# Altium schematic sheet TDC.SchDoc: ACAM TDC + power supply
size 297 x 209 mm; CheckedBy: -; CompanyName: CERN; DrawnBy: GK, TW; Organization: CERN; Address1: European Organization for Nuclear Research; Address2: CH-1211 Genève 23 - Switzerland; Revision: -; SheetNumber: 7; SheetTotal: 9; EDA_Number: EDA-02267-V2-0; Projet: FMC Delay 1ns 4cha; ModifiedBy: -; CreateDate: XX/XX/XXXX; CheckedDate: -; DivGrp: BE-CO; Designer: GK, TW; ModifiedDate: -
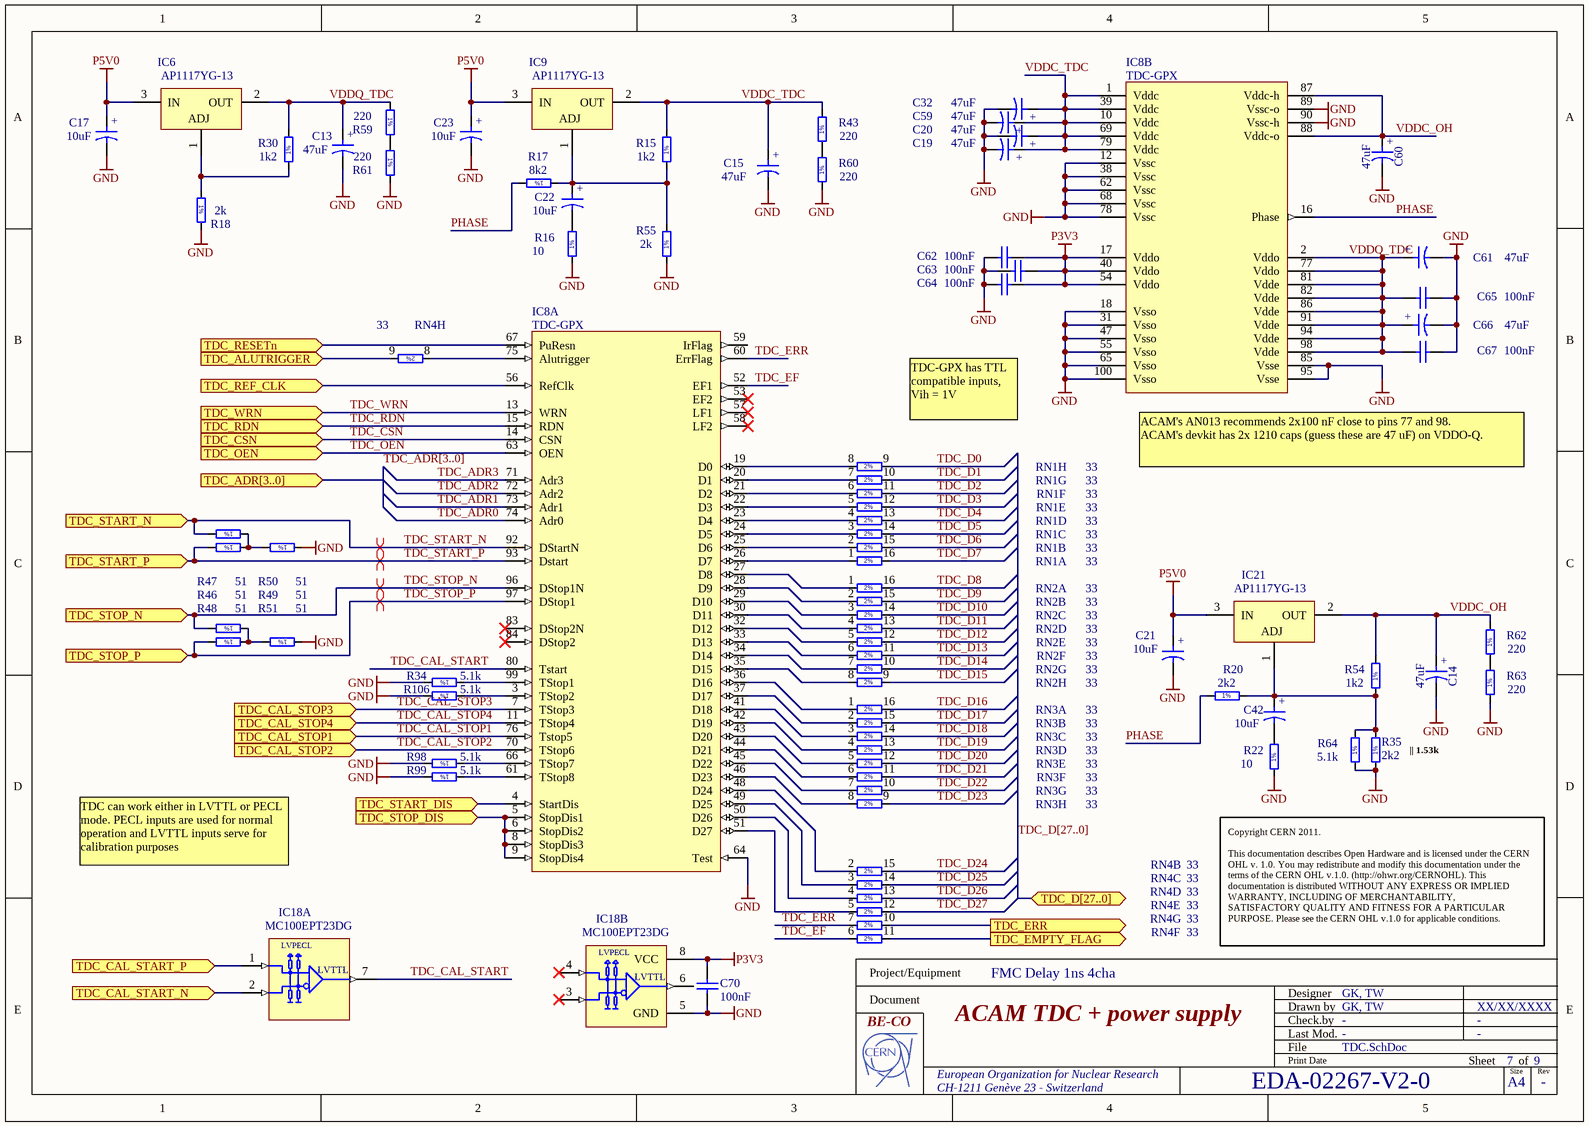
[diagram p0: TDC.SchDoc]

## Parts
C13  47uF  [CAPMP3528X210N]
C14  47uF  [CAPMP3528X210N]
C15  47uF  [CAPMP3528X210N]
C17  10uF  [CAPMP3216X180N]
C19  47uF  [CAPMP3528X210N]
C20  47uF  [CAPMP3528X210N]
C21  10uF  [CAPMP3216X180N]
C22  10uF  [CAPMP3216X180N]
C23  10uF  [CAPMP3216X180N]
C32  47uF  [CAPMP3528X210N]
C42  10uF  [CAPMP3216X180N]
C59  47uF  [CAPMP3528X210N]
C60  47uF  [CAPMP3528X210N]
C61  47uF  [CAPMP3528X210N]
C62  100nF  [CAPC1608X87N]
C63  100nF  [CAPC1608X87N]
C64  100nF  [CAPC1608X87N]
C65  100nF  [CAPC1608X87N]
C66  47uF  [CAPMP3528X210N]
C67  100nF  [CAPC1608X87N]
C70  100nF  [CAPC1608X87N]
IC6  AP1117YG-13  [SOT89]
IC8  TDC-GPX  [QFP50P1600X1600X120-100N]  (parts A,B of 2)
IC9  AP1117YG-13  [SOT89]
IC18  MC100EPT23DG  [SOIC127P600X175-8N]  (parts A,B of 2)
IC21  AP1117YG-13  [SOT89]
R15  1k2  [RESC1608X55N]
R16  10  [RESC1608X55N]
R17  8k2  [RESC1608X55N]
R18  2k  [RESC1608X55N]
R20  2k2  [RESC1608X55N]
R22  10  [RESC1608X55N]
R30  1k2  [RESC1608X55N]
R34  5.1k  [RESC1608X55N]
R35  2k2  [RESC1608X55N]
R43  220  [RESC1608X55N]
R46  51  [RESC1608X55N]
R47  51  [RESC1608X55N]
R48  51  [RESC1608X55N]
R49  51  [RESC1608X55N]
R50  51  [RESC1608X55N]
R51  51  [RESC1608X55N]
R54  1k2  [RESC1608X55N]
R55  2k  [RESC1608X55N]
R59  220  [RESC1608X55N]
R60  220  [RESC1608X55N]
R61  220  [RESC1608X55N]
R62  220  [RESC1608X55N]
R63  220  [RESC1608X55N]
R64  5.1k  [RESC1608X55N]
R98  5.1k  [RESC1608X55N]
R99  5.1k  [RESC1608X55N]
R106  5.1k  [RESC1608X55N]
RN1  33  [RN_YAGEO_YC248]  (parts A,B,C,D,E,F,G,H of 8)
RN2  33  [RN_YAGEO_YC248]  (parts A,B,C,D,E,F,G,H of 8)
RN3  33  [RN_YAGEO_YC248]  (parts A,B,C,D,E,F,G,H of 8)
RN4  33  [RN_YAGEO_YC248]  (parts B,C,D,E,F,G,H of 8)

## Ports
TDC_ADR[3..0] (in), TDC_ALUTRIGGER (in), TDC_CAL_START_N (in), TDC_CAL_START_P (in), TDC_CAL_STOP1 (in), TDC_CAL_STOP2 (in), TDC_CAL_STOP3 (in), TDC_CAL_STOP4 (in), TDC_CSN (in), TDC_D[27..0] (bidir), TDC_EMPTY_FLAG (out), TDC_ERR (out), TDC_OEN (in), TDC_RDN (in), TDC_REF_CLK (in), TDC_RESETn (in), TDC_START_DIS (in), TDC_START_N (in), TDC_START_P (in), TDC_STOP_DIS (in), TDC_STOP_N (in), TDC_STOP_P (in), TDC_WRN (in)

## Nets
GND: C13.2 C14.2 C15.2 C17.2 C19.2 C20.2 C21.2 C23.2 C32.2 C59.2 C60.2 C61.2 C62.2 C63.1 C64.1 C65.2 C66.2 C67.2 C70.1 IC8.12(Vssc) IC8.18(Vsso) IC8.31(Vsso) IC8.38(Vssc) IC8.47(Vsso) IC8.55(Vsso) IC8.62(Vssc) IC8.64(Test) IC8.65(Vsso) IC8.68(Vssc) IC8.78(Vssc) IC8.85(Vsse) IC8.89(Vssc-o) IC8.90(Vssc-h) IC8.95(Vsse) IC8.100(Vsso) IC18.5(GND) R16.1 R18.2 R22.1 R34.2 R35.1 R48.1 R51.1 R55.1 R60.1 R61.2 R63.1 R64.1 R98.2 R99.2 R106.2
P3V3: C62.1 C63.2 C64.2 C70.2 IC8.17(Vddo) IC8.40(Vddo) IC8.54(Vddo) IC18.8(VCC)
P5V0: C17.1 C21.1 C23.1 IC6.3(IN) IC9.3(IN) IC21.3(IN)
PHASE: IC8.16(Phase) R17.2 R20.1
TDC_ADR0: IC8.74(Adr0)
TDC_ADR1: IC8.73(Adr1)
TDC_ADR2: IC8.72(Adr2)
TDC_ADR3: IC8.71(Adr3)
TDC_ALUTRIGGER: RN4.9 ; port TDC_ALUTRIGGER
TDC_CAL_START: IC8.80(Tstart) IC18.7(Q0)
TDC_CAL_START_N: IC18.2(~{D0}) ; port TDC_CAL_START_N
TDC_CAL_START_P: IC18.1(D0) ; port TDC_CAL_START_P
TDC_CAL_STOP1: IC8.76(Tstop5) ; port TDC_CAL_STOP1
TDC_CAL_STOP2: IC8.70(TStop6) ; port TDC_CAL_STOP2
TDC_CAL_STOP3: IC8.7(TStop3) ; port TDC_CAL_STOP3
TDC_CAL_STOP4: IC8.11(TStop4) ; port TDC_CAL_STOP4
TDC_CSN: IC8.14(CSN) ; port TDC_CSN
TDC_D0: RN1.9
TDC_D1: RN1.10
TDC_D2: RN1.11
TDC_D3: RN1.12
TDC_D4: RN1.13
TDC_D5: RN1.14
TDC_D6: RN1.15
TDC_D7: RN1.16
TDC_D8: RN2.16
TDC_D9: RN2.15
TDC_D10: RN2.14
TDC_D11: RN2.13
TDC_D12: RN2.12
TDC_D13: RN2.11
TDC_D14: RN2.10
TDC_D15: RN2.9
TDC_D16: RN3.16
TDC_D17: RN3.15
TDC_D18: RN3.14
TDC_D19: RN3.13
TDC_D20: RN3.12
TDC_D21: RN3.11
TDC_D22: RN3.10
TDC_D23: RN3.9
TDC_D24: RN4.15
TDC_D25: RN4.14
TDC_D26: RN4.13
TDC_D27: RN4.12
TDC_EF: IC8.52(EF1) RN4.6
TDC_EMPTY_FLAG: RN4.11 ; port TDC_EMPTY_FLAG
TDC_ERR: IC8.60(ErrFlag) RN4.7
TDC_ERR: RN4.10 ; port TDC_ERR  [a separate net that carries the same name]
TDC_OEN: IC8.63(OEN) ; port TDC_OEN
TDC_RDN: IC8.15(RDN) ; port TDC_RDN
TDC_REF_CLK: IC8.56(RefClk) ; port TDC_REF_CLK
TDC_RESETn: IC8.67(PuResn) ; port TDC_RESETn
TDC_START_DIS: IC8.4(StartDis) ; port TDC_START_DIS
TDC_START_N: IC8.92(DStartN) R50.2 ; port TDC_START_N
TDC_START_P: IC8.93(Dstart) R49.2 ; port TDC_START_P
TDC_STOP_DIS: IC8.5(StopDis1) IC8.6(StopDis2) IC8.8(StopDis3) IC8.9(StopDis4) ; port TDC_STOP_DIS
TDC_STOP_N: IC8.96(DStop1N) R47.2 ; port TDC_STOP_N
TDC_STOP_P: IC8.97(DStop1) R46.2 ; port TDC_STOP_P
TDC_WRN: IC8.13(WRN) ; port TDC_WRN
VDDC_OH: C14.1 C60.1 IC8.87(Vddc-h) IC8.88(Vddc-o) IC21.2(OUT) R54.2 R62.2
VDDC_TDC: C15.1 C19.1 C20.1 C32.1 C59.1 IC8.1(Vddc) IC8.10(Vddc) IC8.39(Vddc) IC8.69(Vddc) IC8.79(Vddc) IC9.2(OUT) R15.2 R43.2
VDDQ_TDC: C13.1 C61.1 C65.1 C66.1 C67.1 IC6.2(OUT) IC8.2(Vddo) IC8.77(Vddo) IC8.81(Vdde) IC8.82(Vdde) IC8.86(Vdde) IC8.91(Vdde) IC8.94(Vdde) IC8.98(Vdde) R30.2 R59.1
NetC22_1: C22.1 IC9.1(ADJ) R15.1 R17.1 R55.2
NetC22_2: C22.2 R16.2
NetC42_1: C42.1 IC21.1(ADJ) R20.2 R35.2 R54.1 R64.2
NetC42_2: C42.2 R22.2
NetIC6_1: IC6.1(ADJ) R18.1 R30.1
NetIC8_3: IC8.3(TStop2) R106.1
NetIC8_19: IC8.19(D0) RN1.8
NetIC8_20: IC8.20(D1) RN1.7
NetIC8_21: IC8.21(D2) RN1.6
NetIC8_22: IC8.22(D3) RN1.5
NetIC8_23: IC8.23(D4) RN1.4
NetIC8_24: IC8.24(D5) RN1.3
NetIC8_25: IC8.25(D6) RN1.2
NetIC8_26: IC8.26(D7) RN1.1
NetIC8_27: IC8.27(D8) RN2.1
NetIC8_28: IC8.28(D9) RN2.2
NetIC8_29: IC8.29(D10) RN2.3
NetIC8_30: IC8.30(D11) RN2.4
NetIC8_32: IC8.32(D12) RN2.5
NetIC8_33: IC8.33(D13) RN2.6
NetIC8_34: IC8.34(D14) RN2.7
NetIC8_35: IC8.35(D15) RN2.8
NetIC8_36: IC8.36(D16) RN3.1
NetIC8_37: IC8.37(D17) RN3.2
NetIC8_41: IC8.41(D18) RN3.3
NetIC8_42: IC8.42(D19) RN3.4
NetIC8_43: IC8.43(D20) RN3.5
NetIC8_44: IC8.44(D21) RN3.6
NetIC8_45: IC8.45(D22) RN3.7
NetIC8_46: IC8.46(D23) RN3.8
NetIC8_48: IC8.48(D24) RN4.2
NetIC8_49: IC8.49(D25) RN4.3
NetIC8_50: IC8.50(D26) RN4.4
NetIC8_51: IC8.51(D27) RN4.5
NetIC8_61: IC8.61(TStop8) R99.1
NetIC8_66: IC8.66(TStop7) R98.1
NetIC8_75: IC8.75(Alutrigger) RN4.8
NetIC8_99: IC8.99(TStop1) R34.1
NetR43_1: R43.1 R60.2
NetR46_1: R46.1 R47.1 R48.2
NetR49_1: R49.1 R50.1 R51.2
NetR59_2: R59.2 R61.1
NetR62_1: R62.1 R63.2

Not connected (* = marked no-connect by the designer): IC8 53(EF2)* 57(LF1)* 58(LF2)* 59(IrFlag) 83(DStop2N)* 84(DStop2)*; IC18 3(~{D0})* 4(D0)* 6(Q0)

## Buses and harness runs
bus TDC_ADR[3..0] = port TDC_ADR[3..0]
bus TDC_D[27..0] = port TDC_D[27..0]

## Layout directives
differential pair: TDC_START_N, TDC_START_P, TDC_STOP_N, TDC_STOP_P

## Notes on the sheet
- TDC-GPX has TTL compatible inputs, Vih = 1V
- (near IC8) ACAM's AN013 recommends 2x100 nF close to pins 77 and 98.
  ACAM's devkit has 2x 1210 caps (guess these are 47 uF) on VDDO-Q.
- || 1.53k
- TDC can work either in LVTTL or PECL mode. PECL inputs are used for normal operation and LVTTL inputs serve for calibration purposes
- Copyright CERN 2011.
  This documentation describes Open Hardware and is licensed under the CERN OHL v. 1.0. You may redistribute and modify this documentation under the terms of the CERN OHL v.1.0. (http://ohwr.org/CERNOHL). This documentation is distributed WITHOUT ANY EXPRESS OR IMPLIED WARRANTY, INCLUDING OF MERCHANTABILITY, SATISFACTORY QUALITY AND FITNESS FOR A PARTICULAR PURPOSE. Please see the CERN OHL v.1.0 for applicable conditions.
- Project/Equipment
- Document
- Designer
- Drawn by
- Check.by
- File
- Last Mod.
- Print Date
- Sheet
- Size
- A4
- of
- Rev
- (in symbol CTE3216-18_10UF_10V_10%_LESR1800) +
- (in symbol CTE3528-21_47UF_6.3V_10%_LESR0250) +
- (in symbol MC100EPT23DG, part A) LVPECL; LVTTL
- (in symbol MC100EPT23DG, part B) LVPECL; LVTTL
- (in symbol R0603_1K2_1%_0.1W_100PPM) 1%
- (in symbol R0603_2K2_1%_0.1W_100PPM) 1%
- (in symbol R0603_2K_1%_0.1W_100PPM) 1%
- (in symbol R0603_5K1_1%_0.1W_100PPM) 1%
- (in symbol R0603_8K2_1%_0.1W_100PPM) 1%
- (in symbol R0603_10R_1%_0.1W_200PPM) 1%
- (in symbol R0603_51R_1%_0.1W_100PPM) 1%
- (in symbol R0603_220R_1%_0.1W_100PPM) 1%
- (in symbol RN_33R_YAGEO_YC248-JR-0733RL, part A) 2%
- (in symbol RN_33R_YAGEO_YC248-JR-0733RL, part B) 2%
- (in symbol RN_33R_YAGEO_YC248-JR-0733RL, part C) 2%
- (in symbol RN_33R_YAGEO_YC248-JR-0733RL, part D) 2%
- (in symbol RN_33R_YAGEO_YC248-JR-0733RL, part E) 2%
- (in symbol RN_33R_YAGEO_YC248-JR-0733RL, part F) 2%
- (in symbol RN_33R_YAGEO_YC248-JR-0733RL, part G) 2%
- (in symbol RN_33R_YAGEO_YC248-JR-0733RL, part H) 2%

## Library data of the parts
C13-C15 C19 C20 C32 C59-C61 C66 = CTE3528-21_47UF_6.3V_10%_LESR0250: Polarised capacitor; Part Description: Low ESR 0R25 Solid Tantalum Chip Capacitor; Manufacturer: GENERIC; Manufacturer1 Part Number: TPSB476K006R0250; Voltage: 6.3V; Tolerance: ±10%; Table: Capacitors SMD; Part Number: CTE3528-21_47UF_6.3V_10%_LESR0250; Component Kind: Standard; Component Type: Standard; Pin Count: 2; Value: 47uF; Status: Preferred; Manufacturer Part Number: CTE3528-21_47UF_6.3V_10%_LESR0250; Case: B; Mounted: Yes; Socket: No; SMD: Yes; Manufacturer1 Example: AVX; Manufacturer1 ComponentHeight: 2.1mm; HelpURL: \\cern.ch\dfs\Applications\Altium\Datasheets\CTE-LESR_AVX_TPS.pdf; Author: CERN DEM JLC; CreateDate: 5/5/2008; LatestRevisionDate: 1/20/2009
C17 C21-C23 C42 = CTE3216-18_10UF_10V_10%_LESR1800: Polarised capacitor; Part Description: Low ESR 1R8 Solid Tantalum Chip Capacitor; Manufacturer: GENERIC; Manufacturer1 Part Number: TPSA106K010R1800; Voltage: 10V; Tolerance: ±10%; Table: Capacitors SMD; Part Number: CTE3216-18_10UF_10V_10%_LESR1800; Component Kind: Standard; Component Type: Standard; Pin Count: 2; Value: 10uF; Status: Preferred; Manufacturer Part Number: CTE3216-18_10UF_10V_10%_LESR1800; Case: A; Mounted: Yes; Socket: No; SMD: Yes; Manufacturer1 Example: AVX; Manufacturer1 ComponentHeight: 1.8mm; HelpURL: \\cern.ch\dfs\Applications\Altium\Datasheets\CTE-LESR_AVX_TPS.pdf; Author: CERN DEM JLC; CreateDate: 5/5/2008; LatestRevisionDate: 1/20/2009
C62-C65 C67 C70 = CC0603_100NF_50V_10%_X7R: Non-polarised capacitor; Manufacturer1 Part Number: 223858615649; Manufacturer: GENERIC; Part Description: SMD Multilayer Chip Ceramic Capacitor; Table: Capacitors SMD; TC: X7R; Tolerance: ±10%; Voltage: 50V; Author: CERN DEM JLC; Case: 0603; Component Type: Standard; CreateDate: 12/3/2007; HelpURL: \\cern.ch\dfs\Applications\Altium\Datasheets\CC0603_X7R_PHYCOMP.pdf; LatestRevisionDate: 12/3/2007; Manufacturer1 ComponentHeight: 0.87mm; Manufacturer1 Example: PHYCOMP; Manufacturer Part Number: CC0603_100NF_50V_10%_X7R; Mounted: Yes; Pin Count: 2; SMD: Yes; Socket: No; Status: Preferred; Value: 100nF; Part Number: CC0603_100NF_50V_10%_X7R; Component Kind: Standard
IC6 IC9 IC21 = AP1117YG-13: 3-Terminal Regulator 1=Adj 2=OUT 3=IN; Part Description: 1.25V To 5V, 1A Low-Dropout Positive Adjustable Voltage Regulator; Manufacturer: DIODES INCORPORATED; Table: Regulators; Part Number: AP1117YG-13; Component Kind: Standard; Component Type: Standard; Device: AP1117YG-13; PackageDescription: SOT89-3, 3-Leads, Body 2.48x4.5mm; Manufacturer Part Number: AP1117YG-13; Pin Count: 3; Case: SOT89; Mounted: Yes; Socket: No; SMD: Yes; ComponentHeight: 1.6mm; HelpURL: \\cern.ch\dfs\Applications\Altium\Datasheets\AP1117YG-13.pdf; Author: CERN DEM JLC; CreateDate: 5/4/2011; LatestRevisionDate: 5/4/2011
IC8 = TDC-GPX: Multifunctional High-End Time-to-Digital Converter (4 different operation modes, 81 ps up to 10 ps resolution); Manufacturer: ACAM MESS-ELECTRONIC; Table: Analog & Interface; Part Number: TDC-GPX; Component Kind: Standard; Component Type: Standard; Device: TDC-GPX; PackageDescription: QFP,0.50mm pitch,square;100 pin,14.00mm L X 14.00mm W X 1.20mm H body (w/thermal tab), IPC Medium Density; Part Description: Multifunctional High-End Time-to-Digital Converter (4 different operation modes, 81 ps up to 10 ps resolution); Manufacturer Part Number: TDC-GPX; Pin Count: 100; Case: QFP100; Mounted: Yes; Socket: No; SMD: Yes; ComponentHeight: 1.2mm; Author: CERN DEM JLC; HelpURL: \\cern.ch\dfs\Applications\Altium\Datasheets\TDC-GPX.pdf; CreateDate: 7/5/2010; LatestRevisionDate: 7/5/2010
IC18 = MC100EPT23DG: 3.3V Dual Differential LVPECL/LVDS/CML  to LVTTL/LVCMOS Translator; Manufacturer: ON SEMICONDUCTOR; Table: Standard Logic; Part Number: MC100EPT23DG; Component Kind: Standard; Component Type: Standard; Device: MC100EPT23DG; PackageDescription: SOIC 8, Pitch 1.27mm - Body 4x5mm, IPC Medium Density; Part Description: 3.3V Dual Differential LVPECL/LVDS/CML  to LVTTL/LVCMOS Translator; Manufacturer Part Number: MC100EPT23DG; Pin Count: 8; Case: SOIC8; Mounted: Yes; Socket: No; SMD: Yes; ComponentHeight: 1.75mm; Author: CERN DEM JLC; HelpURL: \\cern.ch\dfs\Applications\Altium\Datasheets\MC100EPT23DG.pdf; CreateDate: 1/13/2011; LatestRevisionDate: 1/13/2011
R15 R30 R54 = R0603_1K2_1%_0.1W_100PPM: Resistor - 1%; Part Description: General Purpose Thick Film Chip Resistor; Manufacturer: GENERIC; Manufacturer1 Part Number: NRC06F1201TRF; Power: 0.1W; TC: ±100ppm/°C; Table: Resistors SMD; Part Number: R0603_1K2_1%_0.1W_100PPM; Component Kind: Standard; Component Type: Standard; Pin Count: 2; Value: 1k2; Status: Preferred; Tolerance: ±1%; Manufacturer Part Number: R0603_1K2_1%_0.1W_100PPM; Case: 0603; Mounted: Yes; Socket: No; SMD: Yes; Manufacturer1 Example: NIC COMPONENT; Manufacturer1 ComponentHeight: 0.55mm; HelpURL: \\cern.ch\dfs\Applications\Altium\Datasheets\R0603_NIC_NRC.pdf; Author: CERN DEM JLC; CreateDate: 12/3/2007; LatestRevisionDate: 3/13/2008
R16 R22 = R0603_10R_1%_0.1W_200PPM: Resistor - 1%; Part Description: General Purpose Thick Film Chip Resistor; Manufacturer: GENERIC; Manufacturer1 Part Number: NRC06F10R0TRF; Power: 0.1W; TC: ±200ppm/°C; Table: Resistors SMD; Part Number: R0603_10R_1%_0.1W_200PPM; Component Kind: Standard; Component Type: Standard; Pin Count: 2; Value: 10; Status: Preferred; Tolerance: ±1%; Manufacturer Part Number: R0603_10R_1%_0.1W_200PPM; Case: 0603; Mounted: Yes; Socket: No; SMD: Yes; Manufacturer1 Example: NIC COMPONENT; Manufacturer1 ComponentHeight: 0.55mm; HelpURL: \\cern.ch\dfs\Applications\Altium\Datasheets\R0603_NIC_NRC.pdf; Author: CERN DEM JLC; CreateDate: 12/3/2007; LatestRevisionDate: 6/24/2009
R17 = R0603_8K2_1%_0.1W_100PPM: Resistor - 1%; Part Description: General Purpose Thick Film Chip Resistor; Manufacturer: GENERIC; Manufacturer1 Part Number: NRC06F8201TRF; Power: 0.1W; TC: ±100ppm/°C; Table: Resistors SMD; Part Number: R0603_8K2_1%_0.1W_100PPM; Component Kind: Standard; Component Type: Standard; Pin Count: 2; Value: 8k2; Status: Preferred; Tolerance: ±1%; Manufacturer Part Number: R0603_8K2_1%_0.1W_100PPM; Case: 0603; Mounted: Yes; Socket: No; SMD: Yes; Manufacturer1 Example: NIC COMPONENT; Manufacturer1 ComponentHeight: 0.55mm; HelpURL: \\cern.ch\dfs\Applications\Altium\Datasheets\R0603_NIC_NRC.pdf; Author: CERN DEM JLC; CreateDate: 12/3/2007; LatestRevisionDate: 3/13/2008
R18 R55 = R0603_2K_1%_0.1W_100PPM: Resistor - 1%; Part Description: General Purpose Thick Film Chip Resistor; Manufacturer: GENERIC; Manufacturer1 Part Number: NRC06F2001TRF; Power: 0.1W; TC: ±100ppm/°C; Table: Resistors SMD; Part Number: R0603_2K_1%_0.1W_100PPM; Component Kind: Standard; Component Type: Standard; Pin Count: 2; Value: 2k; Status: Preferred; Tolerance: ±1%; Manufacturer Part Number: R0603_2K_1%_0.1W_100PPM; Case: 0603; Mounted: Yes; Socket: No; SMD: Yes; Manufacturer1 Example: NIC COMPONENT; Manufacturer1 ComponentHeight: 0.55mm; HelpURL: \\cern.ch\dfs\Applications\Altium\Datasheets\R0603_NIC_NRC.pdf; Author: CERN DEM JLC; CreateDate: 12/3/2007; LatestRevisionDate: 3/13/2008
R20 R35 = R0603_2K2_1%_0.1W_100PPM: Resistor - 1%; Part Description: General Purpose Thick Film Chip Resistor; Manufacturer: GENERIC; Manufacturer1 Part Number: NRC06F2201TRF; Power: 0.1W; TC: ±100ppm/°C; Table: Resistors SMD; Part Number: R0603_2K2_1%_0.1W_100PPM; Component Kind: Standard; Component Type: Standard; Pin Count: 2; Value: 2k2; Status: Preferred; Tolerance: ±1%; Manufacturer Part Number: R0603_2K2_1%_0.1W_100PPM; Case: 0603; Mounted: Yes; Socket: No; SMD: Yes; Manufacturer1 Example: NIC COMPONENT; Manufacturer1 ComponentHeight: 0.55mm; HelpURL: \\cern.ch\dfs\Applications\Altium\Datasheets\R0603_NIC_NRC.pdf; Author: CERN DEM JLC; CreateDate: 12/3/2007; LatestRevisionDate: 3/13/2008
R34 R64 R98 R99 R106 = R0603_5K1_1%_0.1W_100PPM: Resistor - 1%; Part Description: General Purpose Thick Film Chip Resistor; Manufacturer: GENERIC; Manufacturer1 Part Number: NRC06F5101TRF; Value: 5k1; Power: 0.1W; TC: ±100ppm/°C; Table: Resistors SMD; Part Number: R0603_5K1_1%_0.1W_100PPM; Component Kind: Standard; Component Type: Standard; Designator: Resistor - 1%; Library Reference: Resistor - 1%; Pin Count: 2; Status: Preferred; Tolerance: ±1%; Manufacturer Part Number: R0603_5K1_1%_0.1W_100PPM; Case: 0603; Mounted: Yes; Socket: No; SMD: Yes; Manufacturer1 Example: NIC COMPONENT; Manufacturer1 ComponentHeight: 0.55mm; HelpURL: \\cern.ch\dfs\Applications\Altium\Datasheets\R0603_NIC_NRC.pdf; Author: CERN DEM JLC; CreateDate: 12/3/2007; LatestRevisionDate: 3/13/2008
R43 R59-R63 = R0603_220R_1%_0.1W_100PPM: Resistor - 1%; Part Description: General Purpose Thick Film Chip Resistor; Manufacturer: GENERIC; Manufacturer1 Part Number: NRC06F2200TRF; Power: 0.1W; TC: ±100ppm/°C; Table: Resistors SMD; Part Number: R0603_220R_1%_0.1W_100PPM; Component Kind: Standard; Component Type: Standard; Pin Count: 2; Value: 220; Status: Preferred; Tolerance: ±1%; Manufacturer Part Number: R0603_220R_1%_0.1W_100PPM; Case: 0603; Mounted: Yes; Socket: No; SMD: Yes; Manufacturer1 Example: NIC COMPONENT; Manufacturer1 ComponentHeight: 0.55mm; HelpURL: \\cern.ch\dfs\Applications\Altium\Datasheets\R0603_NIC_NRC.pdf; Author: CERN DEM JLC; CreateDate: 12/3/2007; LatestRevisionDate: 3/13/2008
R46-R51 = R0603_51R_1%_0.1W_100PPM: Resistor - 1%; Part Description: General Purpose Thick Film Chip Resistor; Manufacturer: GENERIC; Manufacturer1 Part Number: NRC06F51R0TRF; Power: 0.1W; TC: ±100ppm/°C; Table: Resistors SMD; Part Number: R0603_51R_1%_0.1W_100PPM; Component Kind: Standard; Component Type: Standard; Pin Count: 2; Value: 51; Status: Preferred; Tolerance: ±1%; Manufacturer Part Number: R0603_51R_1%_0.1W_100PPM; Case: 0603; Mounted: Yes; Socket: No; SMD: Yes; Manufacturer1 Example: NIC COMPONENT; Manufacturer1 ComponentHeight: 0.55mm; HelpURL: \\cern.ch\dfs\Applications\Altium\Datasheets\R0603_NIC_NRC.pdf; Author: CERN DEM JLC; CreateDate: 12/3/2007; LatestRevisionDate: 3/13/2008
RN1-RN4 = RN_33R_YAGEO_YC248-JR-0733RL: DIL16 Resistor Network 8 Isolated Resistor 5%; Part Description: Chip Resistor Array , 8 Isolated Resistor (Side Convex Terminal), YC248 Serie; Manufacturer: YAGEO; Power: 0.062W; TC: ±200ppm/°C; Table: Resistor Networks SMD; Part Number: RN_33R_YAGEO_YC248-JR-0733RL; Component Kind: Standard; Component Type: Standard; Pin Count: 16; Value: 33; Tolerance: ±5%; Manufacturer Part Number: YC248-JR-0733RL; Mounted: Yes; Socket: No; SMD: Yes; ComponentHeight: 0.55mm; HelpURL: \\cern.ch\dfs\Applications\Altium\Datasheets\RN_YAGEO_YC248.pdf; Author: CERN DEM JLC; CreateDate: 1/13/2011; LatestRevisionDate: 1/13/2011